# Altium project ET4207_DEMO.PrjPcb
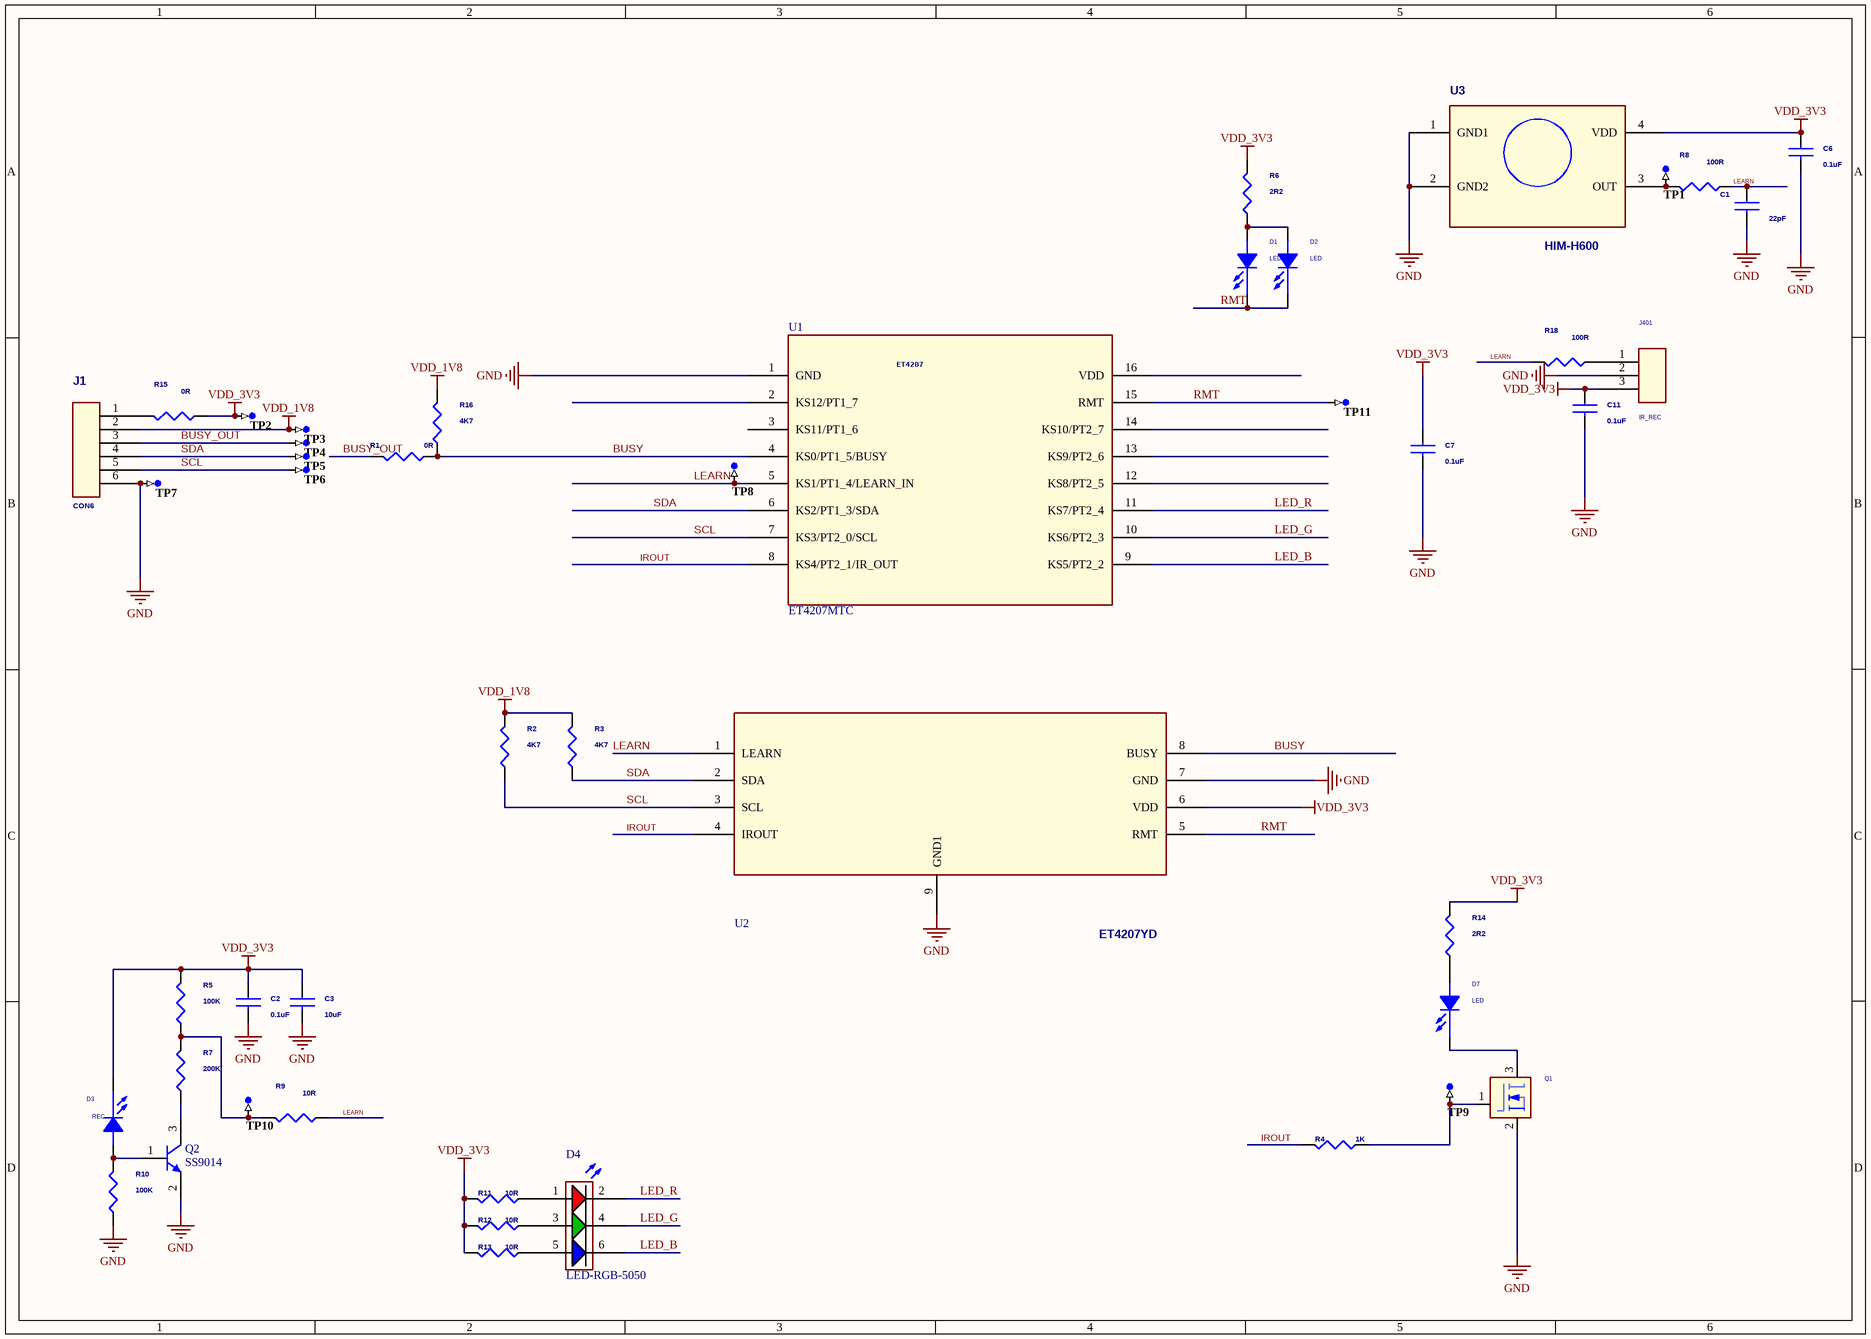
[diagram p0: ET4207_DEMO.SchDoc]
1 sheet, 46 parts. Net scope: global (net labels, ports and power ports of the same name join across sheets).
Board file: ET4207_DEMO.PcbDoc

## Sheet ET4207_DEMO.SchDoc
size 350 x 250 mm

### Parts
C1  22pF  [0805C]
C2  0.1uF  [0805C]
C3  10uF  [0805C]
C6  0.1uF  [0805C]
C7  0.1uF  [0805C]
C11  0.1uF  [0805C]
D1  LED  [LED_A2]
D2  LED  [LED-0805]
D3  REC  [LED_A2]
D4  LED-RGB-5050  [LED-5050]
D7  LED  [LED_A2]
J1  CON6  [HDR1X6]
J401  IR_REC  [IR]
Q1  BSS138LT3G  [SOT-23]  (value not drawn)
Q2  SS9014  [SOT23-3]
R1  0R  [0805R]
R2  4K7  [0805R]
R3  4K7  [0805R]
R4  1K  [0805R]
R5  100K  [0805R]
R6  2R2  [0805R]
R7  200K  [0805R]
R8  100R  [0805R]
R9  10R  [0805R]
R10  100K  [0805R]
R11  10R  [0805R]
R12  10R  [0805R]
R13  10R  [0805R]
R14  2R2  [0805R]
R15  0R  [0805R]
R16  4K7  [0805R]
R18  100R  [0805R]
TP1  PULSE  [TP-SM-C-100]  (value not drawn)  (no BOM)
TP2  3V3  [TP-SM-C-100]  (value not drawn)  (no BOM)
TP3  1V8  [TP-SM-C-100]  (value not drawn)  (no BOM)
TP4  BUSY  [TP-SM-C-100]  (value not drawn)  (no BOM)
TP5  SDA  [TP-SM-C-100]  (value not drawn)  (no BOM)
TP6  SCL  [TP-SM-C-100]  (value not drawn)  (no BOM)
TP7  GND  [TP-SM-C-100]  (value not drawn)  (no BOM)
TP8  LEARN  [TP-SM-C-100]  (value not drawn)  (no BOM)
TP9  IROUT  [TP-SM-C-100]  (value not drawn)  (no BOM)
TP10  DIODE_V  [TP-SM-C-100]  (value not drawn)  (no BOM)
TP11  RMT  [TP-SM-C-100]  (value not drawn)  (no BOM)
U1  ET4207MTC  [soic-16]
U2  ET4207YD  [QFN-8]
U3  HIM-H600  [HIM-H600]

### Nets
GND: C1.2 C2.2 C3.2 C6.2 C7.2 C11.2 J1.6 J401.2(GND) Q1.2(S) Q2.2(E) R10.1 TP7.1 U1.1(GND) U2.7(GND) U2.9(GND1) U3.1(GND1) U3.2(GND2)
VDD_1V8: J1.2 R2.2 R3.2 R16.2 TP3.1
VDD_3V3: C2.1 C3.1 C6.1 C7.1 C11.1 D3.2(CATHODE) J401.3(VCC) R5.2 R6.2 R11.2 R12.2 R13.2 R14.2 R15.1 TP2.1 U2.6(VDD) U3.4(VDD)
BUSY: R1.1 R16.1 U1.4(KS0/PT1_5/BUSY) U2.8(BUSY)
BUSY_OUT: J1.3 R1.2 TP4.1
IROUT: R4.2 U1.8(KS4/PT2_1/IR_OUT) U2.4(IROUT)
LEARN: C1.1 R8.1 R9.1 R18.2 TP8.1 U1.5(KS1/PT1_4/LEARN_IN) U2.1(LEARN)
LED_B: D4.6(B) U1.9(KS5/PT2_2)
LED_G: D4.4(G) U1.10(KS6/PT2_3)
LED_R: D4.2(R) U1.11(KS7/PT2_4)
RMT: D1.2(CATHODE) D2.2(CATHODE) TP11.1 U1.15(RMT) U2.5(RMT)
SCL: J1.5 R2.1 TP6.1 U1.7(KS3/PT2_0/SCL) U2.3(SCL)
SDA: J1.4 R3.1 TP5.1 U1.6(KS2/PT1_3/SDA) U2.2(SDA)
NetD1_1: D1.1(ANODE) D2.1(ANODE) R6.1
NetD3_1: D3.1(ANODE) Q2.1(B) R10.2
NetD4_1: D4.1(R) R11.1
NetD4_3: D4.3(A) R12.1
NetD4_5: D4.5(R) R13.1
NetD7_1: D7.1(ANODE) R14.1
NetD7_2: D7.2(CATHODE) Q1.3(D)
NetJ1_1: J1.1 R15.2
NetJ401_1: J401.1(IROUT) R18.1
NetQ1_1: Q1.1(G) R4.1 TP9.1
NetQ2_3: Q2.3(C) R7.1
NetR5_1: R5.1 R7.2 R9.2 TP10.1
NetR8_2: R8.2 TP1.1 U3.3(OUT)

Not connected (* = marked no-connect by the designer): U1 2(KS12/PT1_7) 3(KS11/PT1_6) 12(KS8/PT2_5) 13(KS9/PT2_6) 14(KS10/PT2_7) 16(VDD)

### Notes on the sheet
- (in symbol ET4207MTC) ET4207

### Library data of the parts
C1-C3 C6 C7 C11 = CAPACITOR NON-POL
D1-D3 D7 = LED_3
D4 = LED-RGB-5050: 三基色LED; Published: 8-Jun-2000; LatestRevisionDate: 08-Jul-2005; LatestRevisionNote: Mech Layer 1 removed.; PackageReference: LED-0; Publisher: Altium Limited
J401 = CON3_0
Q1 = MOSFET_I_EN_GSD: MOSFET N-CH 50V 200MA SOT-23; TI_Part_No: TI-MOS-BSS138LT3G; Mfr_Name: On Semi; Distributor_Part_Number: BSS138LT3GOSCT-ND; Datasheet: http://www.onsemi.com/pub_link/Collateral/BSS138LT1-D.PDF; Mfr_Part_Number: BSS138LT3G
Q2 = SS9014: NPN贴片三极管; Published: 8-Jun-2000; LatestRevisionDate: 15-Jan-2003; LatestRevisionNote: PCB Footprint 'BCY-W3/D4.7' replaced; DatasheetDocument: 1997; PackageDocument: Sep-1998; PackageReference: TO-92A; Publisher: Altium Limited; Code_JEDEC: TO-92A; ComponentLink1Description: Manufacturer Link; ComponentLink1URL: http://www.fairchildsemi.com/; ComponentLink2Description: Datasheet; ComponentLink2URL: http://www.fairchildsemi.com/ds/2N%2F2N3904.pdf
R1-R16 R18 = RESISTOR: MODULE: CPU
TP1-TP11 = TP-SM: Test Point, Surface Mount, Circular, Pad Diameter 1 mm
U3 = LPC111x_7: DEVICE: ET4003YD; MODULE: CPU